# EAGLE schematic LiPo-BoardV1 (EAGLE 9.2.2)
ERSTELLER: Jakob Holz; PROJEKT: LiPo-Baord; VERSION: 1.1
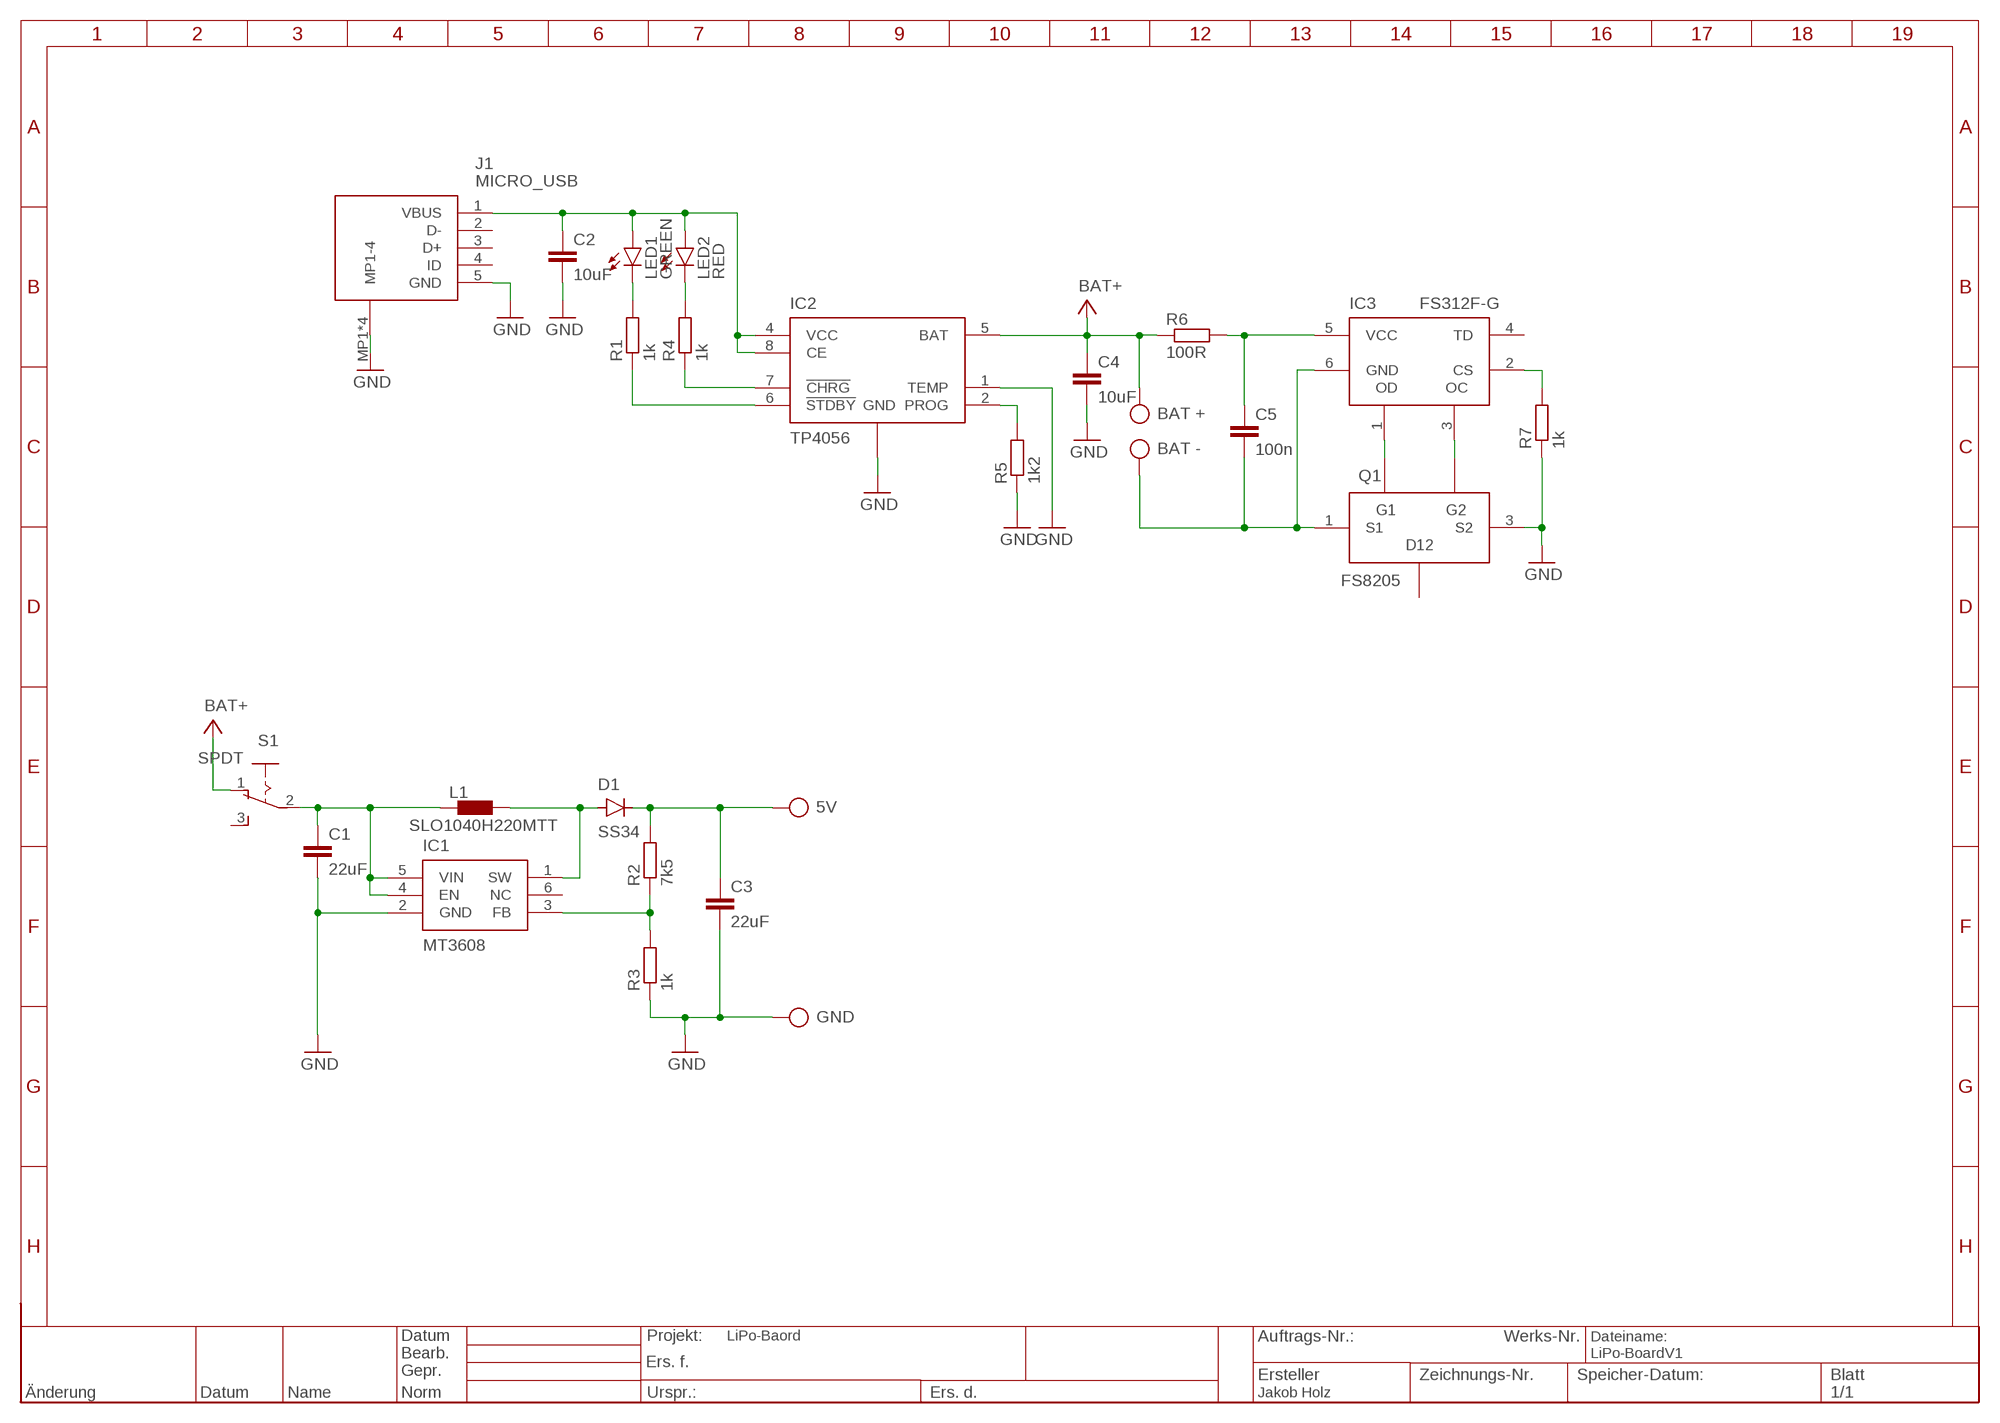
[diagram p0: schematic, sheet 1]

## Parts
C1  22uF  C-EUC1812  [C1812]
C2  10uF  C-EUC0603  [C0603]
C3  22uF  C-EUC1812  [C1812]
C4  10uF  C-EUC0603  [C0603]
C5  100n  C-EUC0603  [C0603]
D1  SS34  DIODE-DO-214AC  [DO-214AC]
IC1  MT3608  [SOT-23-6]
IC2  TP4056  [SOP-8]
IC3  FS312F-G  [SOT-23-6]
J1  MICRO_USB  [MICROUSB]
J2  5V  CON-PAD  [CON-PAD]
J3  GND  CON-PAD  [CON-PAD]
J4  BAT +  CON-PAD  [CON-PAD]
J5  BAT -  CON-PAD  [CON-PAD]
L1  SLO1040H220MTT  [INDUCTOR10.8X10]
LED1  GREEN  LEDCHIPLED_0603  [CHIPLED_0603]
LED2  RED  LEDCHIPLED_0603  [CHIPLED_0603]
Q1  FS8205  [SOT-23-6]
R1  1k  R-EU_R0603  [R0603]
R2  7k5  R-EU_R0603  [R0603]
R3  1k  R-EU_R0603  [R0603]
R4  1k  R-EU_R0603  [R0603]
R5  1k2  R-EU_R0603  [R0603]
R6  100R  R-EU_R0603  [R0603]
R7  1k  R-EU_R0603  [R0603]
S1  SPDT  [SPDT]

## Nets
5V: C3.1 D1.C J2.1 R2.2
BAT+: C4.1 IC2.5(BAT) J4.1 R6.1 S1.1
BAT-: C5.2 IC3.6(GND) J5.1 Q1.1(S1)
GND: C1.2 C2.2 C3.2 C4.2 IC1.2(GND) IC2.1(TEMP) IC2.3(GND) IC2.9(GND) J1.5(GND) J1.MP1(MP1-4) J1.MP2(MP1-4) J1.MP3(MP1-4) J1.MP4(MP1-4) J3.1 Q1.3(S2) R3.1 R5.1 R7.1
N$1: D1.A IC1.1(SW) L1.2
N$2: LED1.C R1.2
N$3: LED2.C R4.2
N$4: IC2.7(!CHRG) R4.1
N$5: IC2.6(!STDBY) R1.1
N$6: IC1.3(FB) R2.1 R3.2
N$7: IC2.2(PROG) R5.2
N$10: IC3.1(OD) Q1.6(G1)
N$11: IC3.3(OC) Q1.4(G2)
N$12: IC3.2(CS) R7.2
N$13: C5.1 IC3.5(VCC) R6.2
VBUS: C2.1 IC2.4(VCC) IC2.8(CE) J1.1(VBUS) LED1.A LED2.A
VIN: C1.1 IC1.4(EN) IC1.5(VIN) L1.1 S1.2
Unconnected: IC1.6(NC) IC3.4(TD) J1.2(D-) J1.3(D+) J1.4(ID) Q1.2(D12) Q1.5(D12) S1.3

## Library data of the parts
C1 C3 = resistor:C-EU: CAPACITOR, European symbol
C2 C4 C5 = rcl:C-EU: CAPACITOR, European symbol; SPICEPREFIX: C
D1 = diode:DIODE-: DIODE
IC1 = Jakobs_LBR:MT3608: High Efficiency 1.2MHz 2A Step Up Converter Source: Datasheet <https://www.olimex.com/Products/Breadboarding/BB-PWR-3608/resources/MT3608.pdf>; DESCRIPTION: High Efficiency 1.2MHz 2A Step Up Converter; HEIGHT: 1.45mm; MANUFACTURER_NAME: Aerosemi; MANUFACTURER_PART_NUMBER: MT3608
IC2 = Jakobs_LBR:TP4056: 1A Standalone Linear Li-lon Battery Charger, SOP-8 Source: Datasheet <https://dlnmh9ip6v2uc.cloudfront.net/datasheets/Prototyping/TP4056.pdf>; DESCRIPTION: 1A Standalone Linear Li-lon Battery Charger, SOP-8; HEIGHT: 1.75mm; MANUFACTURER_NAME: NanJing Top Power; MANUFACTURER_PART_NUMBER: TP4056
IC3 = Jakobs_LBR:FS312F-G: One Cell Lithium-ion/Polymer Battery Protection IC Source: Datasheet <https://www.ic-fortune.com/upload/Download/FS312F-G-DS-12_EN.pdf>; DESCRIPTION: One Cell Lithium-ion/Polymer Battery Protection IC; HEIGHT: 1.45mm; MANUFACTURER_NAME: Fortune Semiconductor Corporation; MANUFACTURER_PART_NUMBER: FS312F-G
J1 = Jakobs_LBR:MICRO_USB
J2-J5 = Jakobs_LBR:CON-PAD
L1 = Jakobs_LBR:SLO1040H220MTT; DC_CURRENT: 4A; DC_RESISTANCE: 66mΩ; INDUCTANCE: 22uH; SATURATION_CURRENT: 5.5A
LED1 LED2 = led:LED: LED OSRAM: - CHIPLED LG R971, LG N971, LY N971, LG Q971, LY Q971, LO R971, LY R971 LH N974, LH R974 LS Q976, LO Q976, LY Q976 LO Q996 - Hyper CHIPLED LW Q18S LB Q993, LB Q99A, LB R99A - SideLED LS A670, LO A670, LY A670, LG A670, LP A670 LB A673, LV A673, LT A673, LW A673 LH A674 LY A675 LS A676, LA A676, LO A676, LY A676, LW A676 LS A679, LY A679, LG A679 - Hyper Micro SIDELED® LS Y876, LA Y876, LO Y876, LY Y876 LT Y87S - SmartLED LW L88C, LW L88S LB L89C, LB L89S, LG L890 LS L89K, LO L89K, LY L89K LS L896, LA L896, LO L896, LY L896 - TOPLED LS T670, LO T670, LY T670, LG T670, LP T670 LSG T670, LSP T670, LSY T670, LOP T670, LYG T670 LG T671, LOG T671, LSG T671 LB T673, LV T673, LT T673, LW T673 LH T674 LS T676, LA T676, LO T676, LY T676, LB T676, LH T676, LSB T676, LW T676 LB T67C, LV T67C, LT T67C, LS T67K, LO T67K, LY T67K, LW E67C LS E67B, LA E67B, LO E67B, LY E67B, LB E67C, LV E67C, LT E67C LW T67C LS T679, LY T679, LG T679 LS T770, LO T770, LY T770, LG T770, LP T770 LB T773, LV T773, LT T773, LW T773 LH T774 LS E675, LA E675, LY E675, LS T675 LS T776, LA T776, LO T776, LY T776, LB T776 LHGB T686 LT T68C, LB T68C - Hyper Mini TOPLED® LB M676 - Mini TOPLED Santana® LG M470 LS M47K, LO M47K, LY M47K Source: http://www.osram.convergy.de LUXEON: - LUMILED® LXK2-PW12-R00, LXK2-PW12-S00, LXK2-PW14-U00, LXK2-PW14-V00 LXK2-PM12-R00, LXK2-PM12-S00, LXK2-PM14-U00 LXK2-PE12-Q00, LXK2-PE12-R00, LXK2-PE12-S00, LXK2-PE14-T00, LXK2-PE14-U00 LXK2-PB12-K00, LXK2-PB12-L00, LXK2-PB12-M00, LXK2-PB14-N00, LXK2-PB14-P00, LXK2-PB14-Q00 LXK2-PR12-L00, LXK2-PR12-M00, LXK2-PR14-Q00, LXK2-PR14-R00 LXK2-PD12-Q00, LXK2-PD12-R00, LXK2-PD12-S00 LXK2-PH12-R00, LXK2-PH12-S00 LXK2-PL12-P00, LXK2-PL12-Q00, LXK2-PL12-R00 Source: www.luxeon.com KINGBRIGHT: KA-3528ASYC Source: www.kingbright.com
Q1 = Jakobs_LBR:FS8205: DUAL N-CHANNEL ENHANCEMENT MODE POWER MOFSET Source: Datasheet <https://www.ic-fortune.com/upload/Download/FS8205-DS-19_EN.pdf>; DESCRIPTION: DUAL N-CHANNEL ENHANCEMENT MODE POWER MOFSET; HEIGHT: 1mm; MANUFACTURER_NAME: Fortune Semiconductor Corporation; MANUFACTURER_PART_NUMBER: FS8205
R1-R7 = rcl:R-EU_: RESISTOR, European symbol; SPICEPREFIX: R
S1 = Jakobs_LBR:SPDT